# Altium schematic sheet 0025_DDR5 SODIMM CONTRO.SchDoc
size 848 x 558 mm
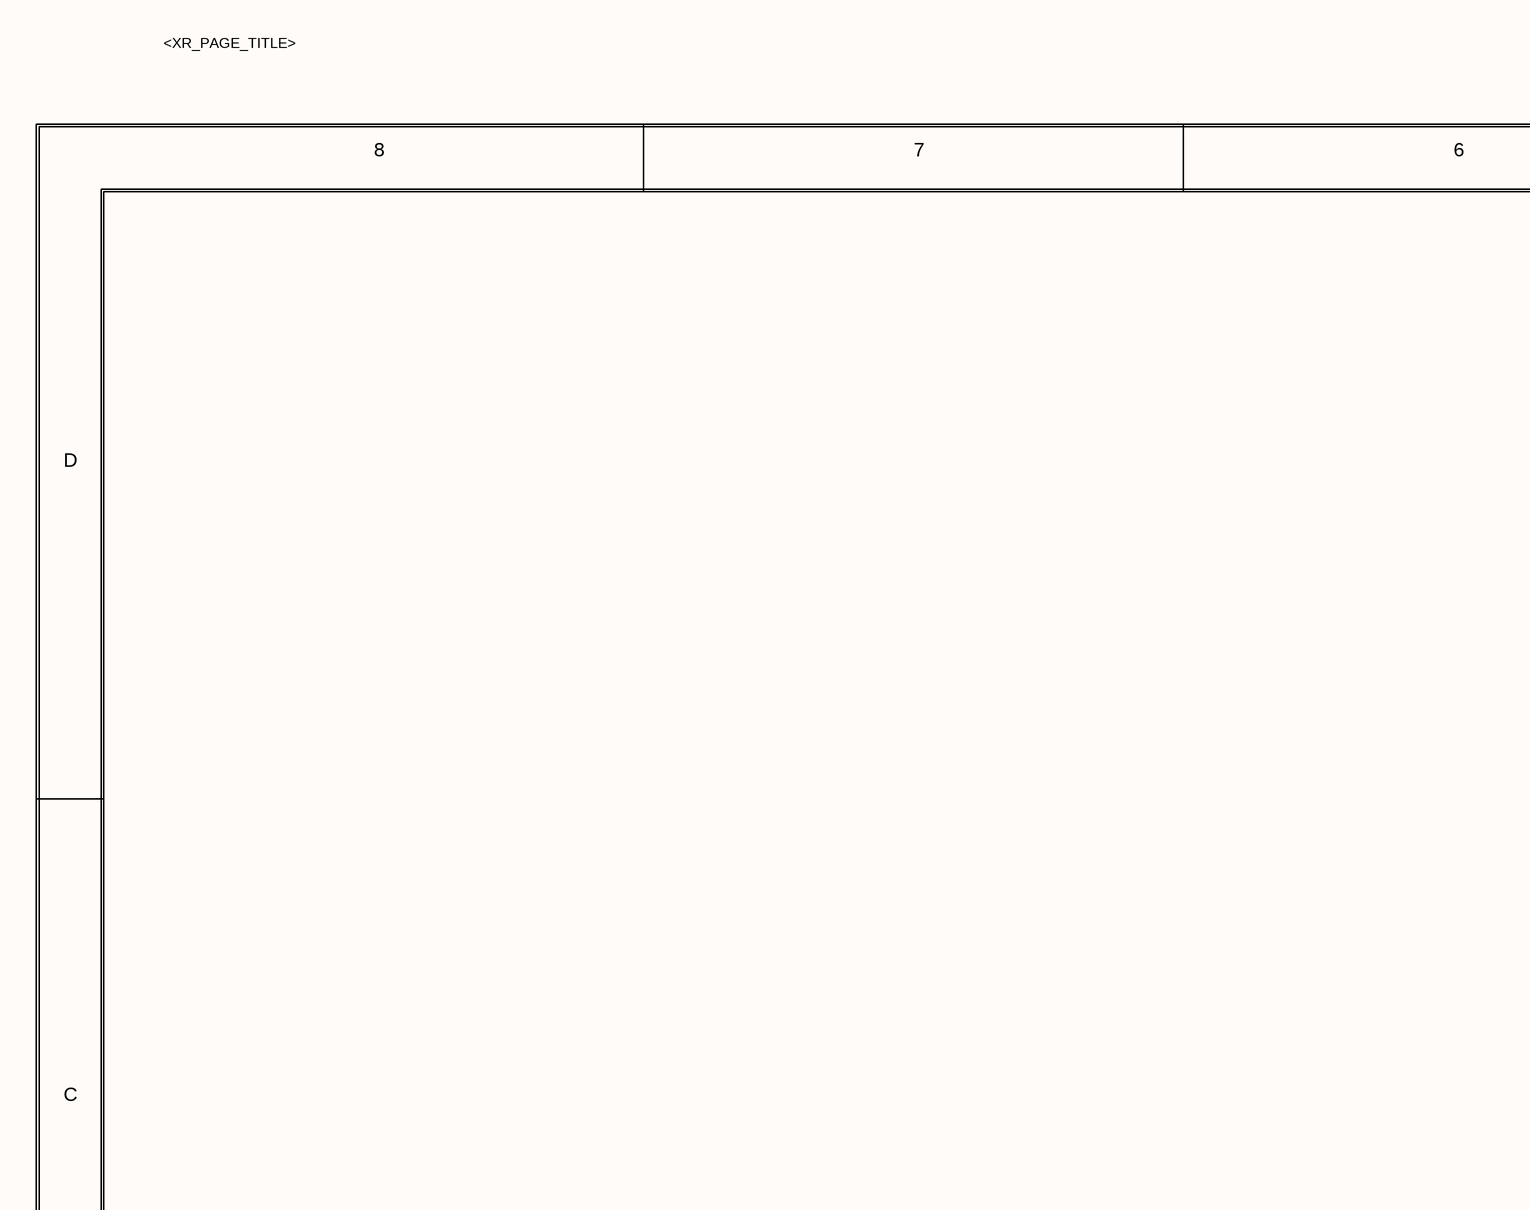
[diagram p0: 0025_DDR5 SODIMM CONTRO.SchDoc, top left]
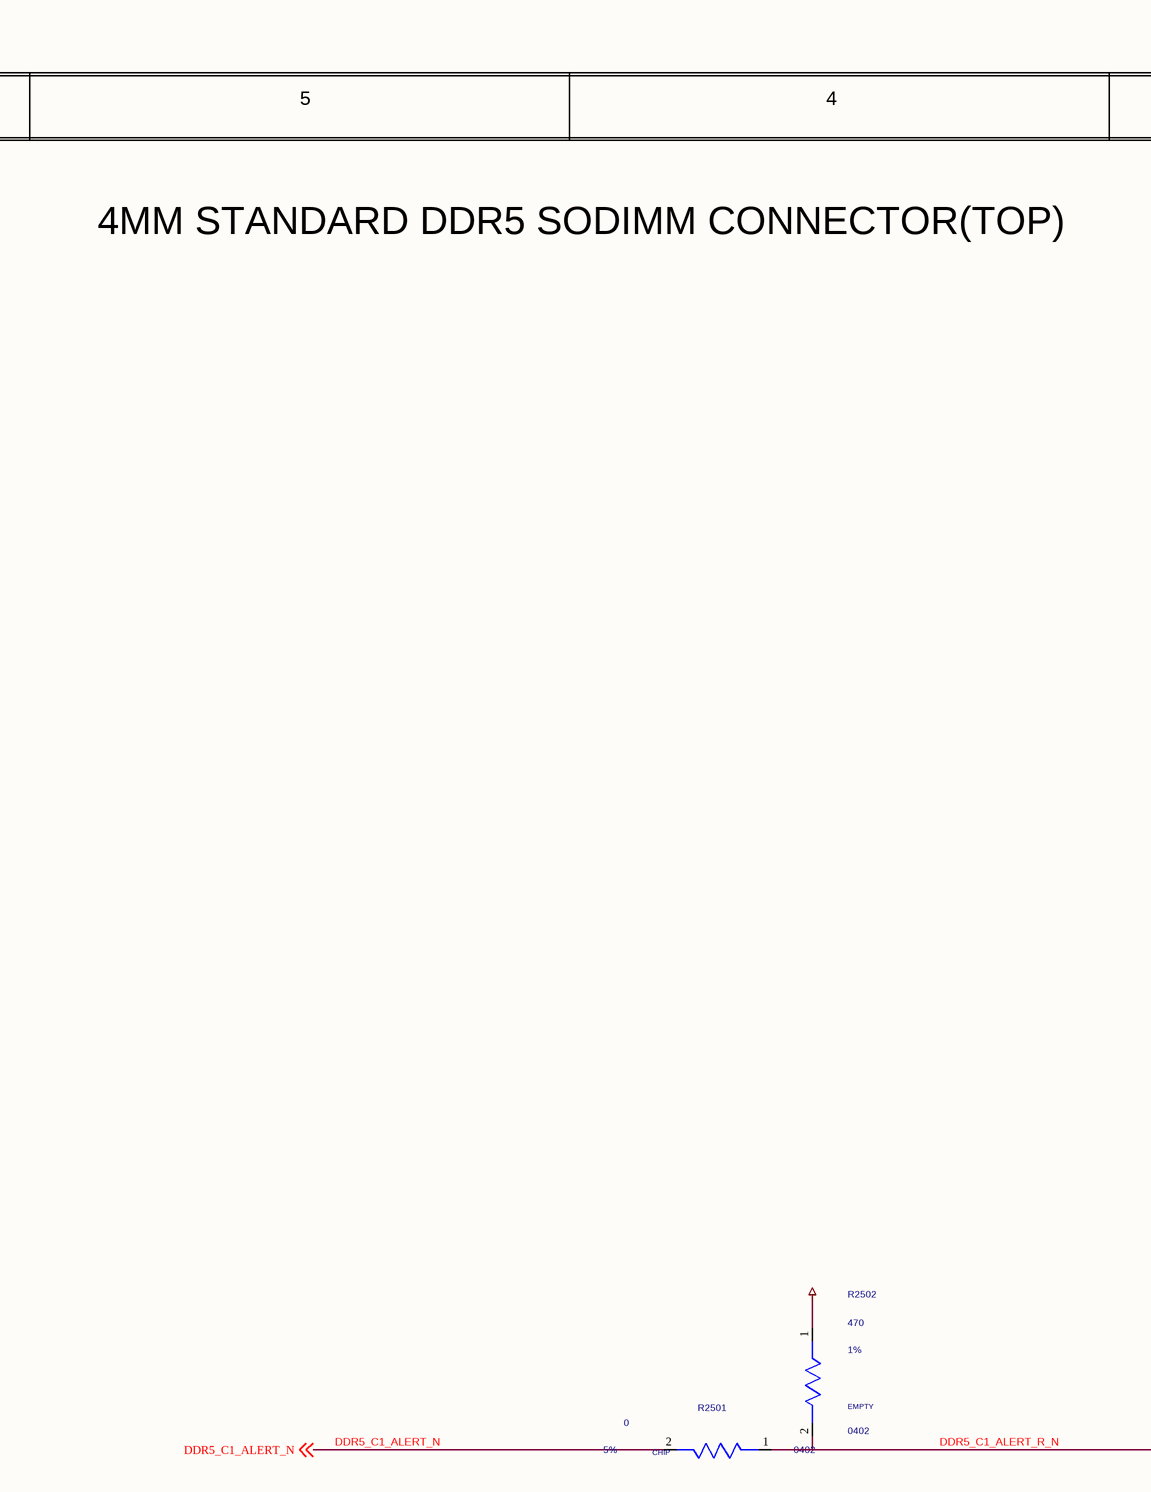
[diagram p1: 0025_DDR5 SODIMM CONTRO.SchDoc, top middle]
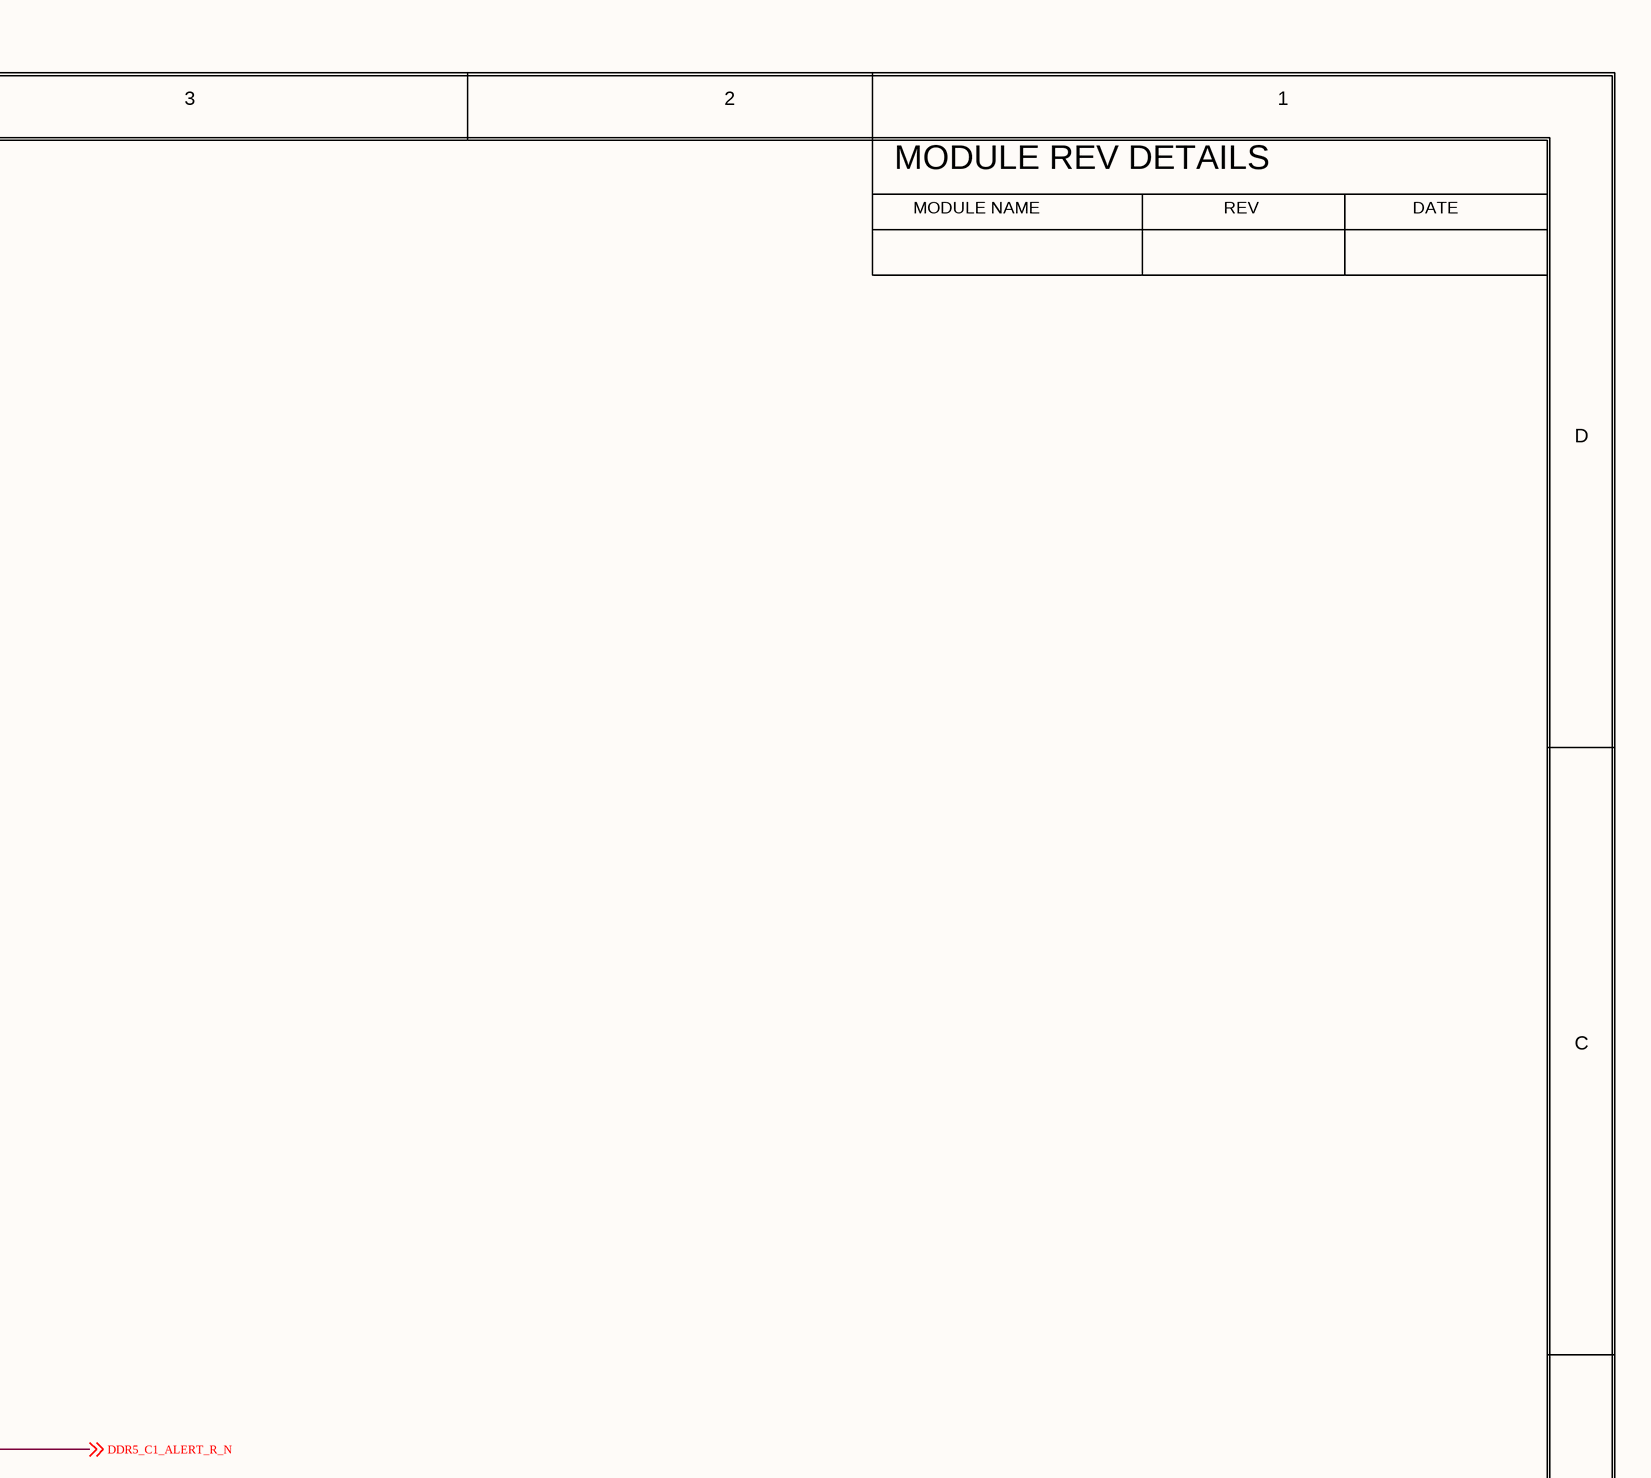
[diagram p2: 0025_DDR5 SODIMM CONTRO.SchDoc, top right]
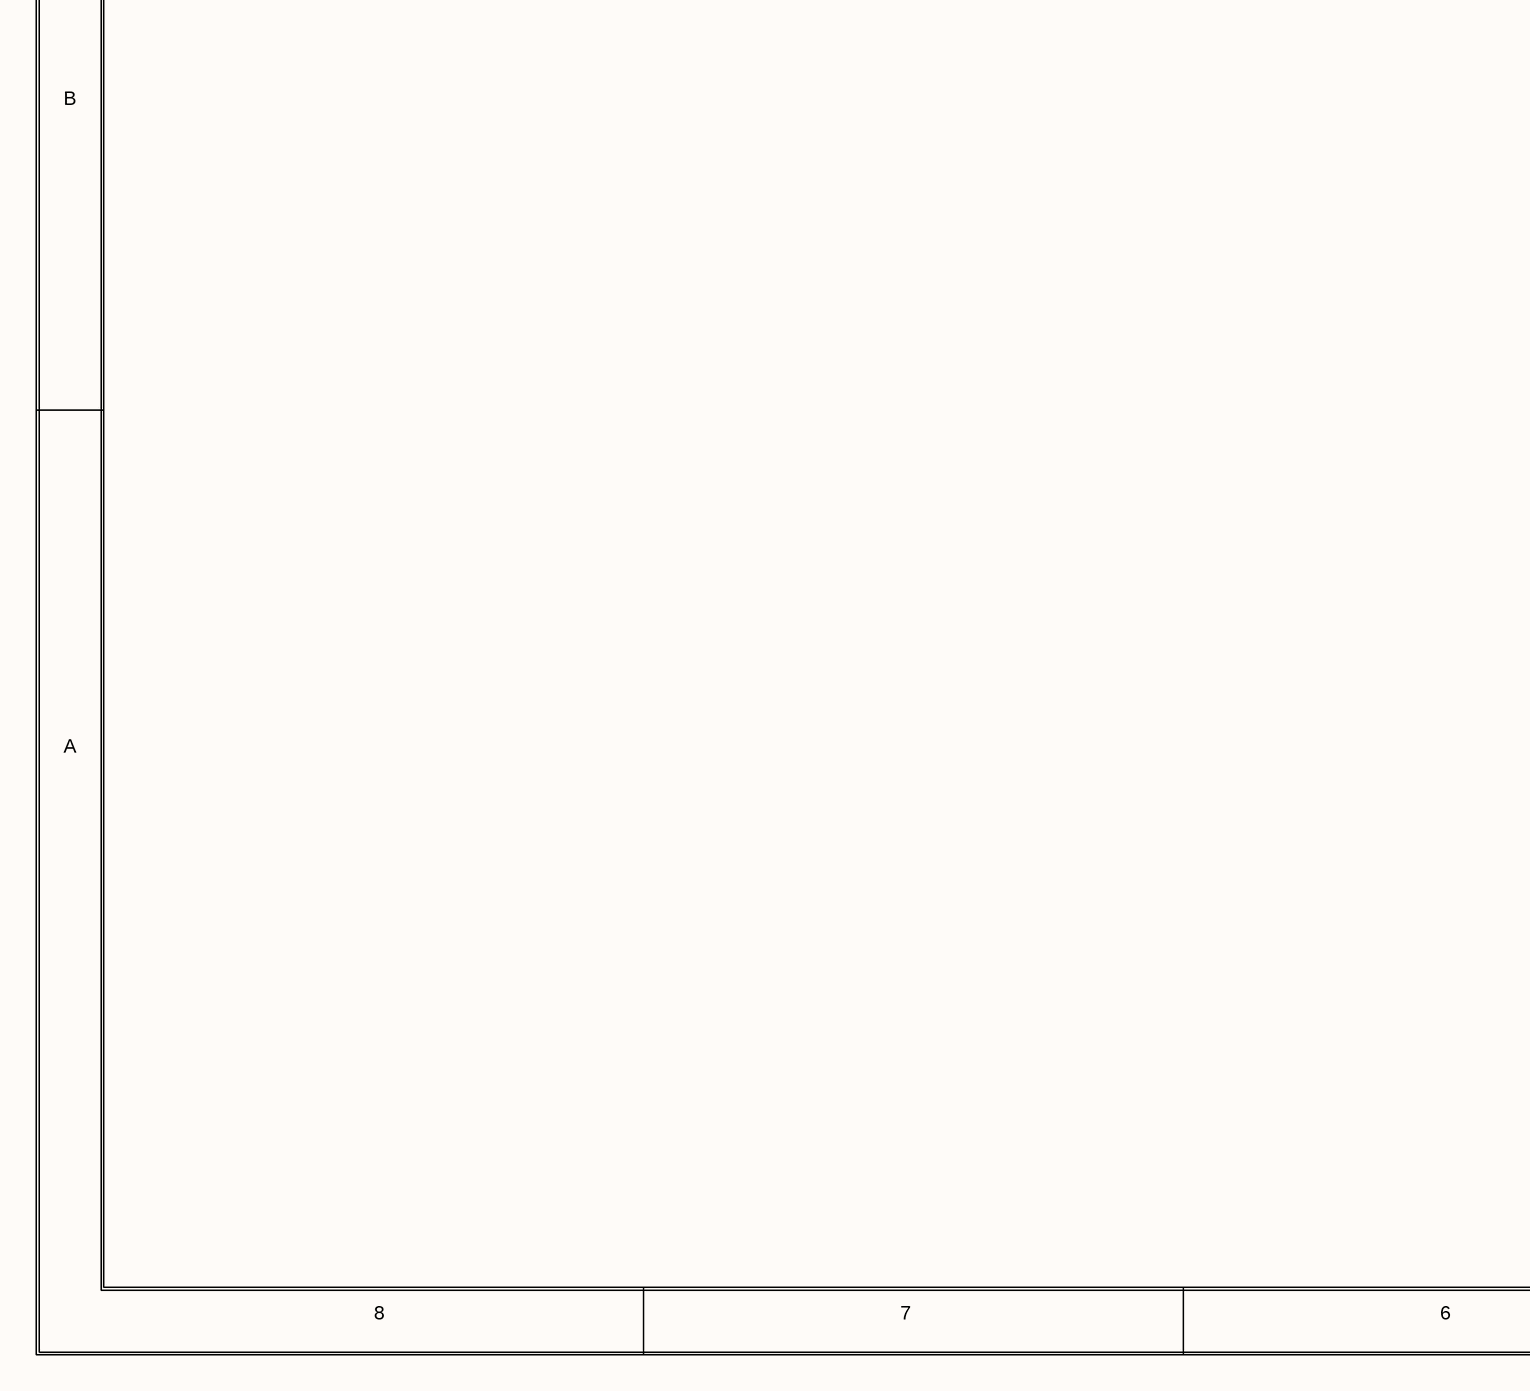
[diagram p3: 0025_DDR5 SODIMM CONTRO.SchDoc, bottom left]
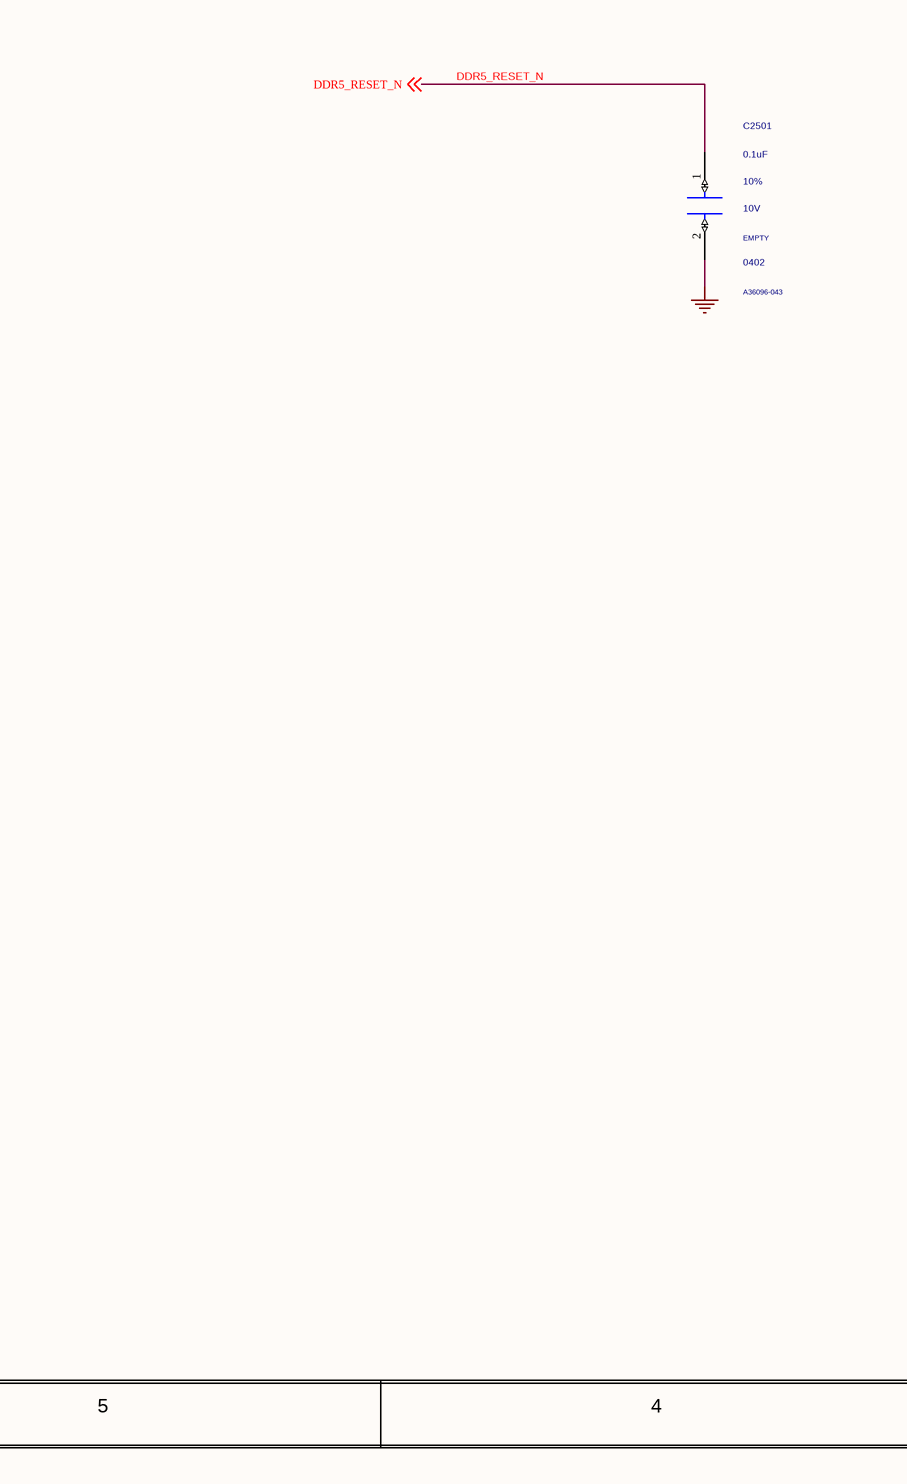
[diagram p4: 0025_DDR5 SODIMM CONTRO.SchDoc, bottom middle]
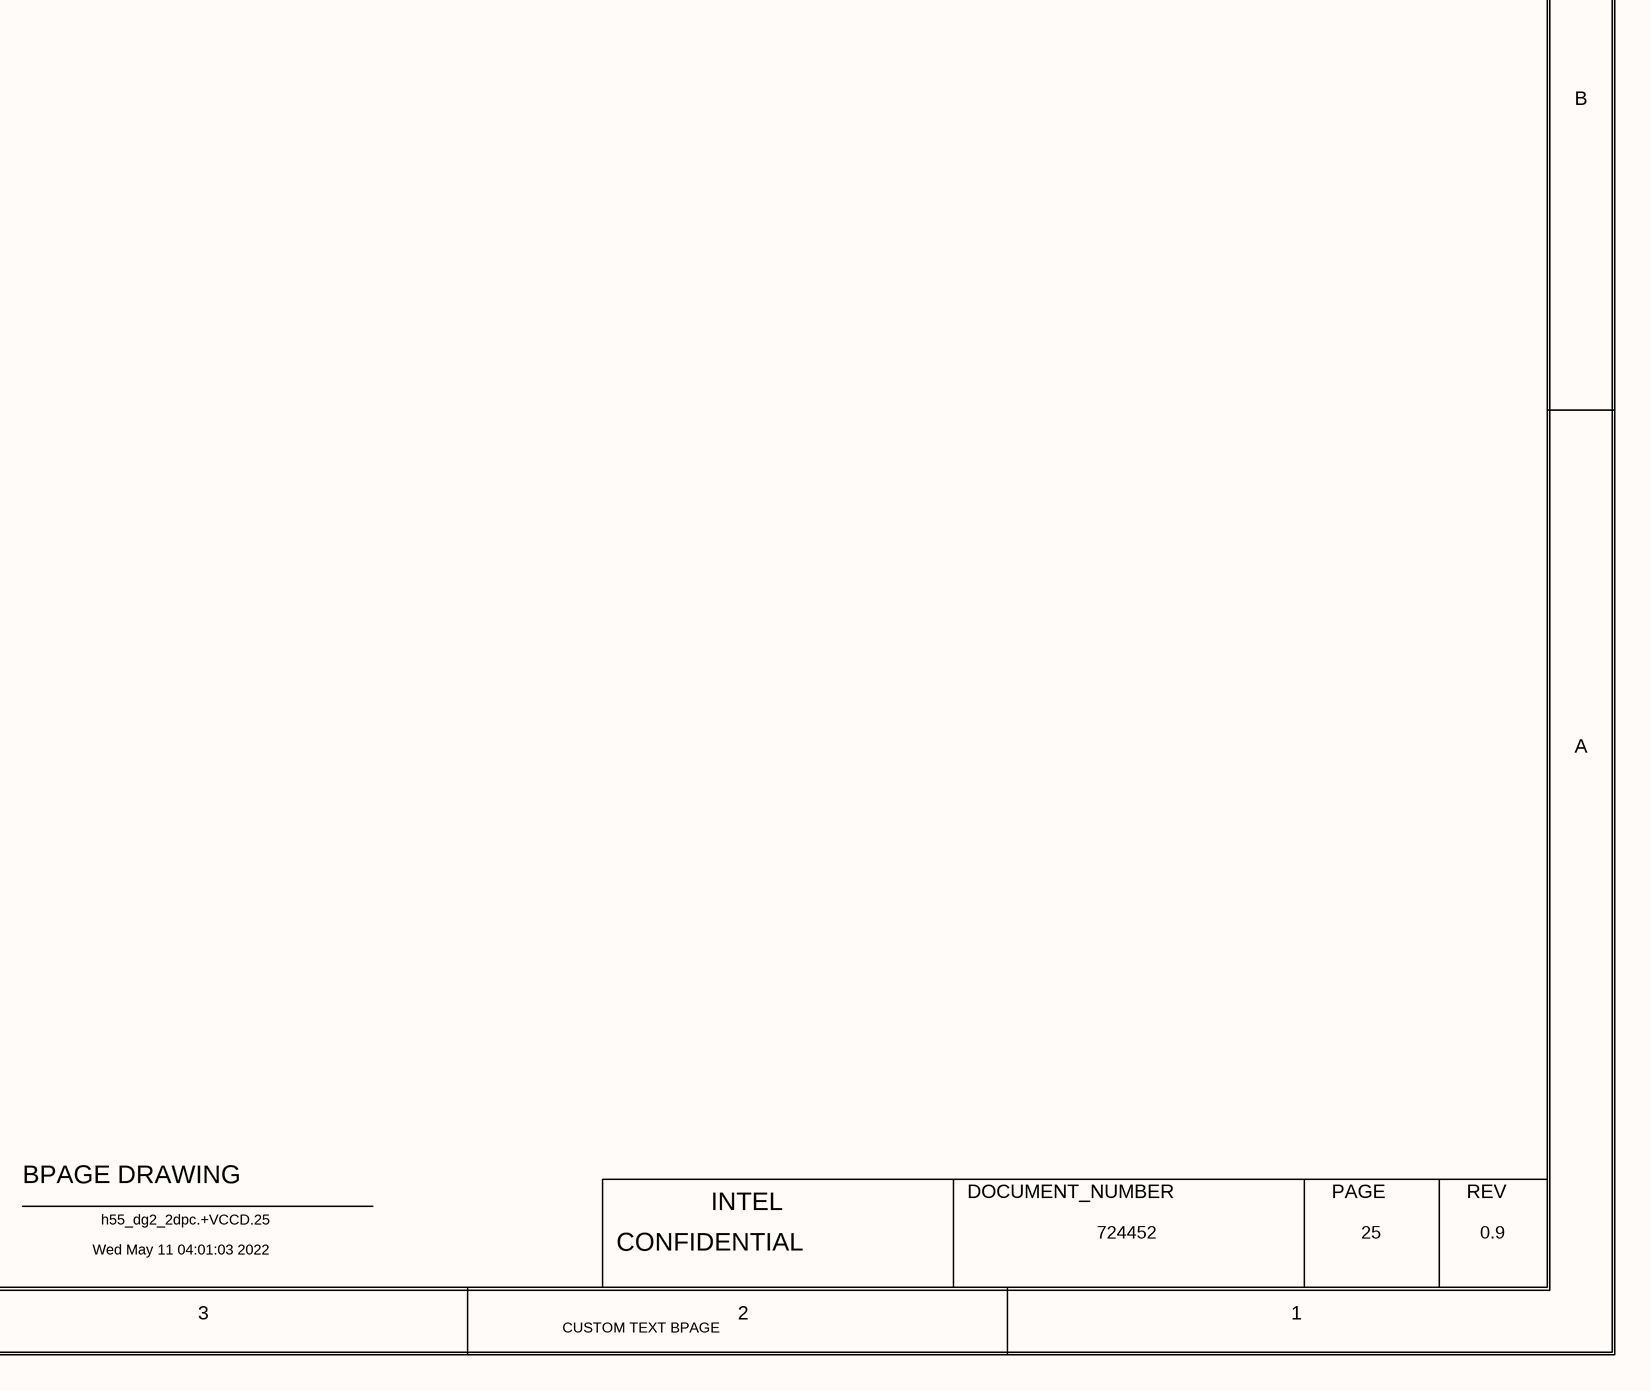
[diagram p5: 0025_DDR5 SODIMM CONTRO.SchDoc, bottom right]

## Parts
C2501  0.1uF  MATERIAL: EMPTY  PACK_TYPE: 0402  PART_NUMBER: A36096-043  TOLERANCE: 10%  VOLTAGE: 10V  [SMC0402IA]
R2501  0  MATERIAL: CHIP  PACK_TYPE: 0402  TOLERANCE: 5%  [SMR0402IA]
R2502  470  MATERIAL: EMPTY  PACK_TYPE: 0402  TOLERANCE: 1%  [SMR0402IA]

## Nets
+VCCDD2_PROC: R2502.1(A)
GND: C2501.2(B)
DDR5_C1_ALERT_N: R2501.2(B) ; off-sheet DDR5_C1_ALERT_N
DDR5_C1_ALERT_R_N: R2501.1(A) R2502.2(B) ; off-sheet DDR5_C1_ALERT_R_N
DDR5_RESET_N: C2501.1(A) ; off-sheet DDR5_RESET_N

## Notes on the sheet
- <XR_PAGE_TITLE>
- 8
- 7
- 6
- 5
- 4
- 3
- 2
- 1
- MODULE REV DETAILS
- 4MM STANDARD DDR5 SODIMM CONNECTOR(TOP)
- MODULE NAME
- REV
- DATE
- D
- C
- B
- A
- BPAGE DRAWING
- INTEL
- DOCUMENT_NUMBER
- PAGE
- Wed May 11 04:01:03 2022
- h55_dg2_2dpc.+VCCD.25
- CONFIDENTIAL
- 724452
- 25
- 0.9
- CUSTOM TEXT BPAGE

## Library data of the parts
C2501 = CAP: CDS_PHYS_PART_NAME: CAP_0402-A36096-043,EMPTY,0.1UF,10V,10%,LPDB,GENERIC; OriginalSymbolOrigin: (-50,25); XY: (-10075,2250); VER: 1; ROT: 0; PHYS_PAGE: 25; LOCATION: C2501; IP: GENERIC; FP_TECH: LPDB; DRAWING: @RVP1_ADL_SB_ADP_S_DDR5_SODIMM_2DPC_LIB.H55_DG2_2DPC(SCH_1):PAGE25; CDS_LIB: discrete; PCB Footprint: SMC0402IA; SEC_TYPE: 0402; CHIPS_PART_NAME: CAP; CDS_PART_NAME: CAP_0402-A36096-043,EMPTY,0.1UF,10V,10%,LPDB,GENERIC; CDS_LOCATION: C2501
R2501 = RES#1: PART_NUMBER: A93549-001; CHIPS_PART_NAME: RES; CDS_PHYS_PART_NAME: RES_0402-A93549-001,CHIP,0,5%,1/16W,LPDB,GENERIC; WATTAGE: 1/16W; OriginalSymbolOrigin: (-75,25); XY: (-10400,2650); VER: 1; ROT: 2; PHYS_PAGE: 25; LOCATION: R2501; IP: GENERIC; FP_TECH: LPDB; DRAWING: @RVP1_ADL_SB_ADP_S_DDR5_SODIMM_2DPC_LIB.H55_DG2_2DPC(SCH_1):PAGE25; CDS_LIB: discrete; PCB Footprint: SMR0402IA; CDS_PART_NAME: RES_0402-A93549-001,CHIP,0,5%,1/16W,LPDB,GENERIC; CDS_LOCATION: R2501
R2502 = RES: PART_NUMBER: G64084-066; CDS_PHYS_PART_NAME: RES_0402-G64084-066,EMPTY,470,1%,1/16W,LPDB,GENERIC; WATTAGE: 1/16W; OriginalSymbolOrigin: (-25,75); XY: (-10225,2775); VER: 2; ROT: 0; PHYS_PAGE: 25; LOCATION: R2502; IP: GENERIC; FP_TECH: LPDB; DRAWING: @RVP1_ADL_SB_ADP_S_DDR5_SODIMM_2DPC_LIB.H55_DG2_2DPC(SCH_1):PAGE25; CDS_LIB: discrete; PCB Footprint: SMR0402IA; CHIPS_PART_NAME: RES; CDS_PART_NAME: RES_0402-G64084-066,EMPTY,470,1%,1/16W,LPDB,GENERIC; CDS_LOCATION: R2502